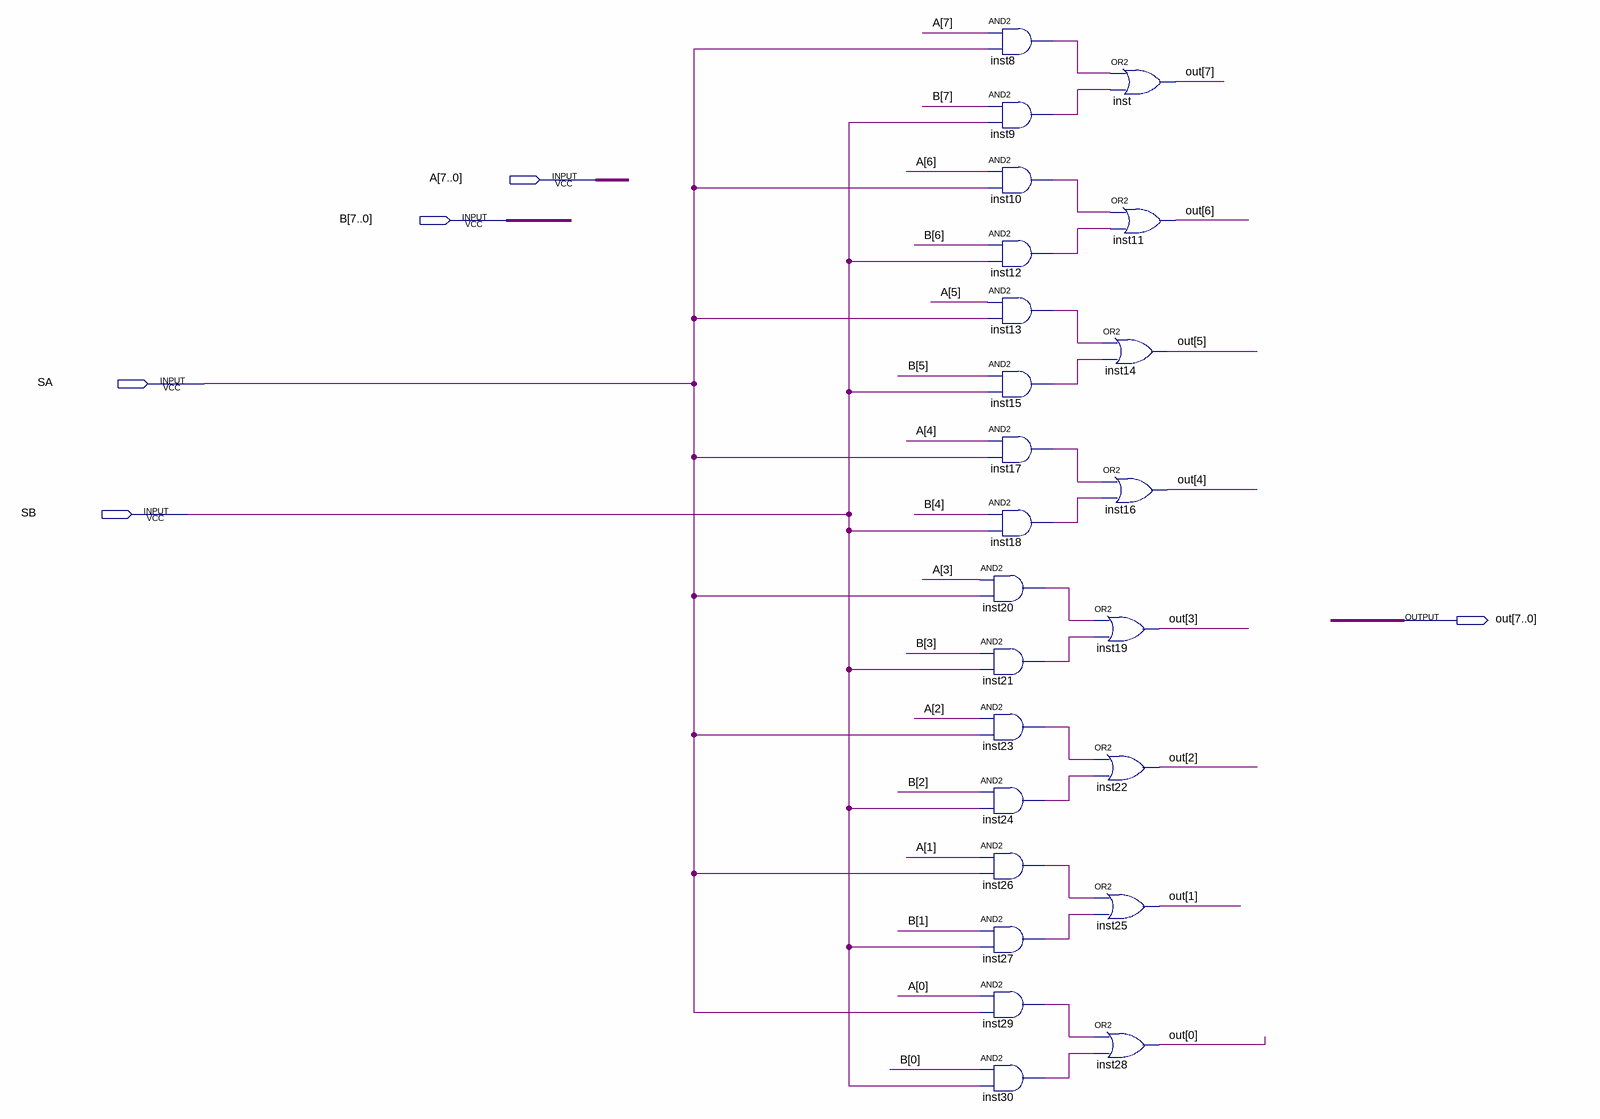
[diagram p0: schematic sheet]
// Quartus schematic select2.bdf as structural Verilog: 24 symbols, 5 pins
module select2 (
  input  [7:0] A,
  input  [7:0] B,
  input  SA,
  input  SB,
  output [7:0] out
);

  wire inst8_out, inst9_out, inst10_out, inst12_out, inst13_out, inst15_out, inst17_out, inst18_out,
       inst20_out, inst21_out, inst23_out, inst24_out, inst26_out, inst27_out, inst29_out, inst30_out;

  and inst20 (inst20_out, A[3], SA);
  and inst21 (inst21_out, B[3], SB);
  and inst23 (inst23_out, A[2], SA);
  and inst24 (inst24_out, B[2], SB);
  and inst26 (inst26_out, A[1], SA);
  and inst27 (inst27_out, B[1], SB);
  and inst29 (inst29_out, A[0], SA);
  and inst30 (inst30_out, B[0], SB);
  and inst8 (inst8_out, A[7], SA);
  and inst9 (inst9_out, B[7], SB);
  and inst10 (inst10_out, A[6], SA);
  and inst12 (inst12_out, B[6], SB);
  and inst13 (inst13_out, A[5], SA);
  and inst15 (inst15_out, B[5], SB);
  and inst17 (inst17_out, A[4], SA);
  and inst18 (inst18_out, B[4], SB);
  or inst (out[7], inst8_out, inst9_out);
  or inst11 (out[6], inst10_out, inst12_out);
  or inst14 (out[5], inst13_out, inst15_out);
  or inst16 (out[4], inst17_out, inst18_out);
  or inst19 (out[3], inst20_out, inst21_out);
  or inst22 (out[2], inst23_out, inst24_out);
  or inst25 (out[1], inst26_out, inst27_out);
  or inst28 (out[0], inst29_out, inst30_out);
endmodule
